# EAGLE design Adafruit SHT31-D STEMMA QT Breakout (EAGLE 9.6.2)
COMPANY: ADAFRUIT INDUSTRIES; DRAWN: KTOWN; REV: A
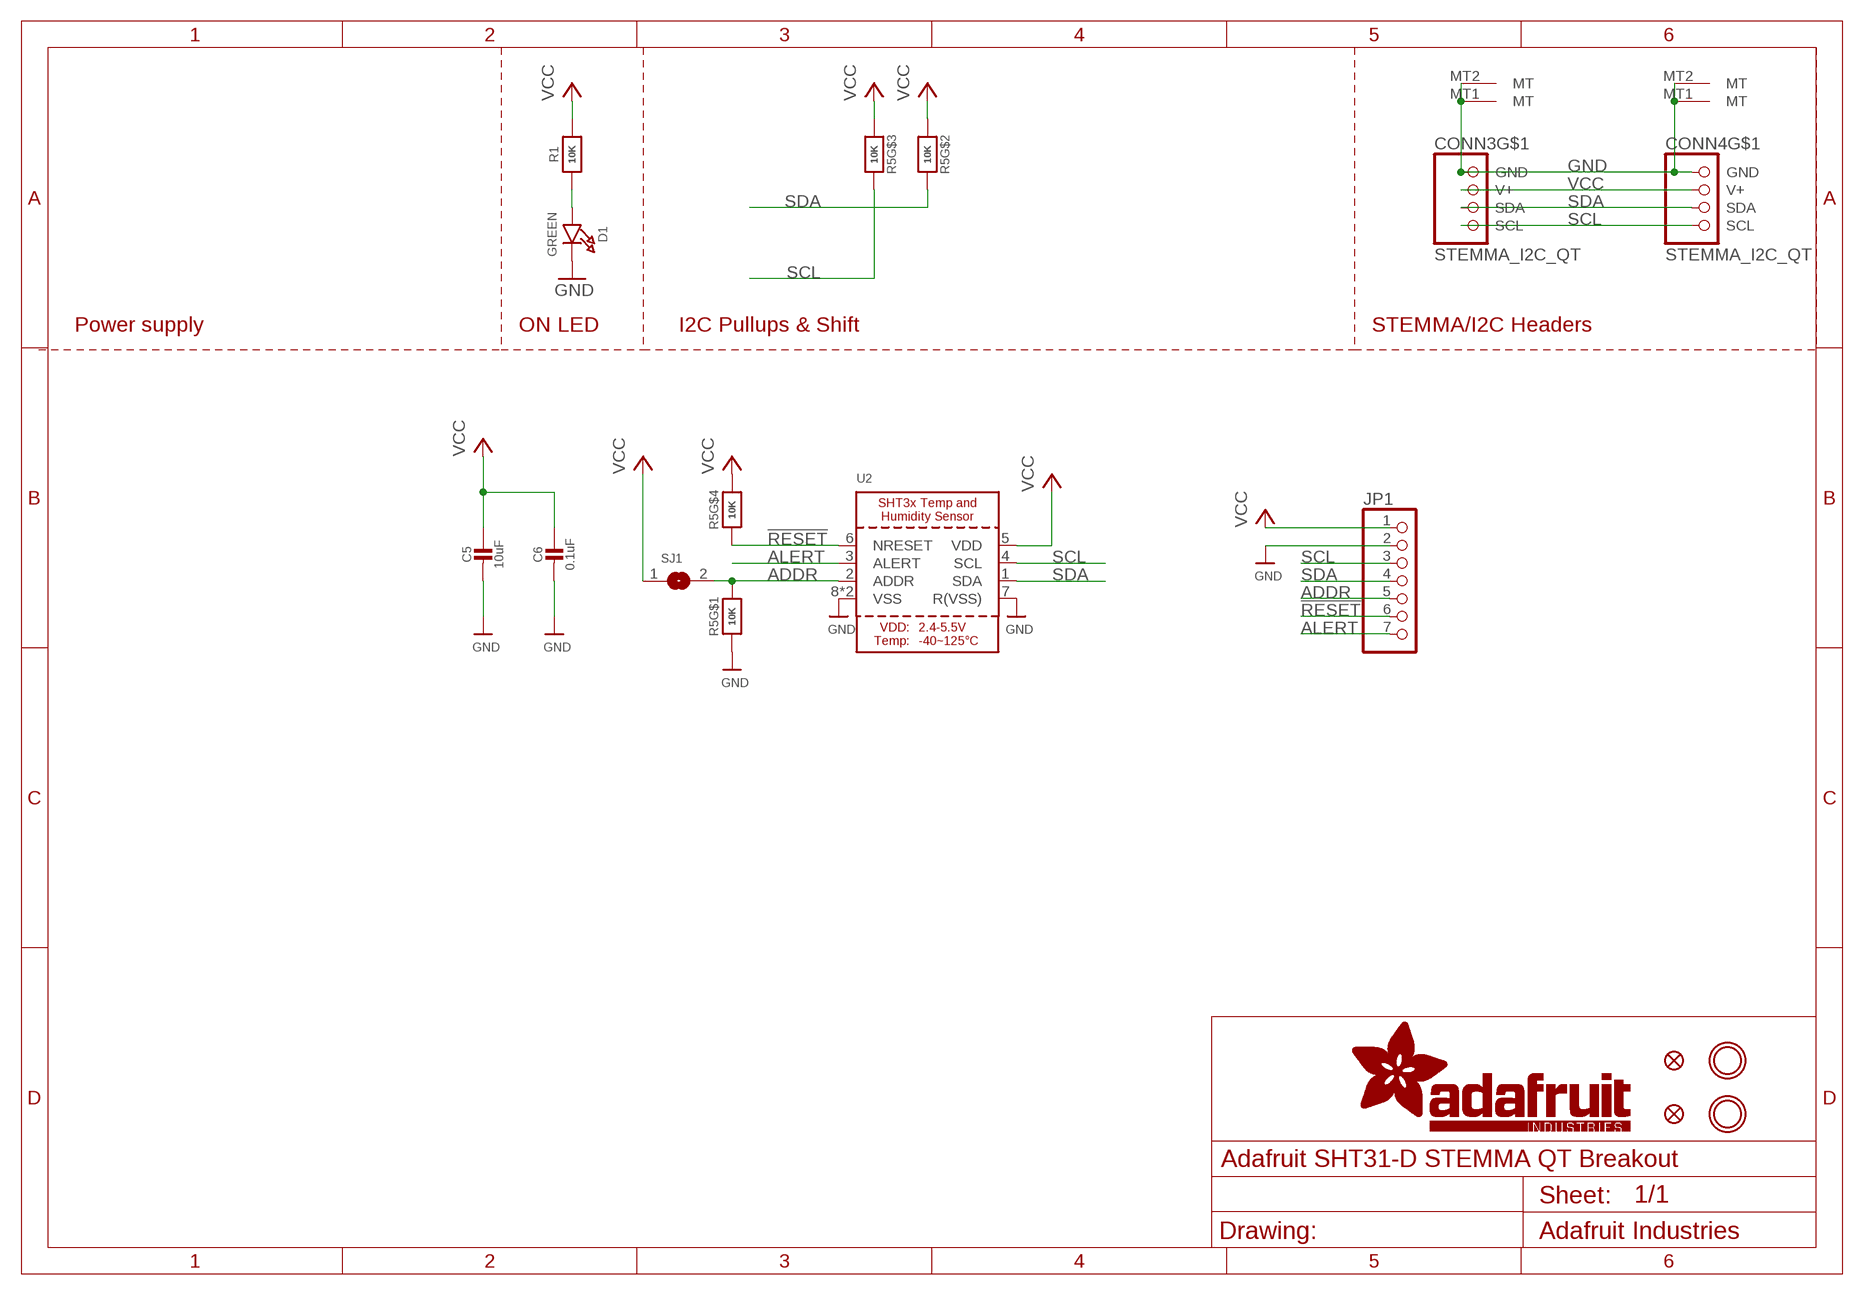
[diagram p0: schematic, sheet 1]

## Parts
C5  10uF  CAP_CERAMIC0805-NOOUTLINE  [0805-NO]
C6  0.1uF  CAP_CERAMIC0603_NO  [0603-NO]
CONN3  STEMMA_I2C_QT  [JST_SH4]
CONN4  STEMMA_I2C_QT  [JST_SH4]
D1  GREEN  LED0603_NOOUTLINE  [CHIPLED_0603_NOOUTLINE]
FID3  FIDUCIAL_1MM  [FIDUCIAL_1MM]
FID4  FIDUCIAL_1MM  [FIDUCIAL_1MM]
JP1  HEADER-1X770MIL  [1X07_ROUND_70]
R1  10K  RESISTOR_0603_NOOUT  [0603-NO]
R5  10K  RESISTOR_4PACK  [RESPACK_4X0603]
SJ1  SOLDERJUMPER  [SOLDERJUMPER_ARROW_NOPASTE]
U2  SHT3X  [SHT3X]
U$19  MOUNTINGHOLE2.5  [MOUNTINGHOLE_2.5_PLATED]
U$20  MOUNTINGHOLE2.5  [MOUNTINGHOLE_2.5_PLATED]

## Nets
!RESET: JP1.6 R5.4 U2.6(NRESET)
ADDR: JP1.5 R5.8 SJ1.2 U2.2(ADDR)
ALERT: JP1.7 U2.3(ALERT)
GND: C5.2 C6.2 CONN3.1(GND) CONN3.MT1(MT) CONN3.MT2(MT) CONN4.1(GND) CONN4.MT1(MT) CONN4.MT2(MT) D1.C JP1.2 R5.1 U2.7(R(VSS)) U2.8(VSS) U2.THERMAL(VSS)
N$1: D1.A R1.1
SCL: CONN3.4(SCL) CONN4.4(SCL) JP1.3 R5.6 U2.4(SCL)
SDA: CONN3.3(SDA) CONN4.3(SDA) JP1.4 R5.7 U2.1(SDA)
VCC [highpower]: C5.1 C6.1 CONN3.2(V+) CONN4.2(V+) JP1.1 R1.2 R5.2 R5.3 R5.5 SJ1.1 U2.5(VDD)

## Notes on the sheet
- Power supply | ON LED | I2C Pullups & Shift | STEMMA/I2C Headers

## Library data of the parts
C5 C6 = microbuilder:CAP_CERAMIC: Ceramic Capacitors For new designs, use the packages preceded by an '_' character since they are more reliable: The following footprints should be used on most boards: _0402 - Standard footprint for regular board layouts _0603 - Standard footprint for regular board layouts _0805 - Standard footprint for regular board layouts _1206 - Standard footprint for regular board layouts For extremely tight-pitch boards where space is at a premium, the following 'micro-pitch' footprints can be used (smaller pads, no silkscreen outline, etc.): _0402MP - Micro-pitch footprint for very dense/compact boards _0603MP - Micro-pitch footprint for very dense/compact boards _0805MP - Micro-pitch footprint for very dense/compact boards _1206MP - Micro-pitch footprint for very dense/compact boards
CONN3 CONN4 = microbuilder:STEMMA_I2C
D1 = microbuilder:LED: LED 0603 - 0603 Surface Mount Package 2mA: Green LED - Low Power (3.9mcd, 2ma, 1.7Vf) - Digikey: 475-2709-2-ND Orange LED - Low Power (9.8mcd, 2ma, 1.8Vf) - Digikey: 475-1194-2-ND Red LED - Low Power (5mcd, 2ma, 1.8Vf) - Digikey: 475-1195-2-ND Yellow LED - Low Power (7mcd, 2ma, 1.8Vf) - Digikey: 475-1196-2-ND 5mA: Blue LED - Low Power (17mcd, 5ma, 2.9Vf) - Digikey: LNJ937W8CRACT-ND 0805 - 0805 Surface Mount Package 2mA: Red LED (8.8mcd, 2mA, 1.8Vf, Clear) - Low Power [Digikey: 475-2510-1-ND] Green LED (5mcd, 2mA, 1.8Vf, Clear) - Low Power [Digikey: 475-2730-1-ND] Yellow LED (11.3mcd, 2mA, 1.8Vf, Clear) - Low Power [Digikey: 475-2555-1-ND] 20mA: Red LED (104mcd, 20mA, Diffused) - LS R976 [Digikey: 475-1278-6-ND] Red LED (12mcd, 20mA, 2.0Vf, Clear) - APT2012EC [Digikey: 754-1128-1-ND] Green LED (15mcd, 20mA, 2.2Vf, Clear) - APT2012GC [Digikey: 754-1131-1-ND] Orange LED (160mcd, 20mA, 2.1Vf, Clear) - APT2012SECK [Digikey: 754-1130-1-ND] 1206 - 1206 Surface Mount Package Green LED (26mcd, 20mA, Diffused) - LG N971 [Digikey: 475-1407-6-ND] Red LED (15mcd, 20mA, Diffused) - LH N974 [Digikey: 475-1416-6-ND] Cree - Cree High-Power Surface Mount LEDs XPEBWT-L1-0000-00D50 - White 111lm 350mA 2.9Vf 6200K 110° XTEAWT-00-0000-00000LEE3 - White 114lm 350mA 2.85Vf 5000K 115° Everlight - Everlight 45-21 Series Surface Mount LEDs 45-21/QK2C-B2832AC2CB2/2T - Warm White 2000mcd 20mA 3.25Vf 3050K 120° 45-21/LK2C-B38452C4CB2/2T - Nuetral White 2000mcd 20mA 3.25Vf 4150K 120° 45-21/LK2C-B50634C6CB2/2T - Cold White 2200mcd 20mA 3.25Vf 5650K 120° PLCC2 Reverse Mount LS T77K-J1L2-1-0-2-R18-Z - Red 11.25mcd 2mA 1.8Vf 630nm 120° LO T77K-L1M2-24-Z - Orange 19.6mcd 2mA 1.8Vf 606nm 120° LY T77K-K2M1-26-Z - Yellow 15.7mcd 2mA 1.8Vf 587nm 120°
FID3 FID4 = microbuilder:FIDUCIAL: Fiducial Alignment Points Various fiducial points for machine vision alignment.; BOM: EXCLUDE
JP1 = microbuilder:HEADER-1X7: PIN HEADER
R1 = microbuilder:RESISTOR: Resistors For new designs, use the packages preceded by an '_' character since they are more reliable: The following footprints should be used on most boards: _0402 - Standard footprint for regular board layouts _0603 - Standard footprint for regular board layouts _0805 - Standard footprint for regular board layouts _1206 - Standard footprint for regular board layouts For extremely tight-pitch boards where space is at a premium, the following 'micro-pitch' footprints can be used (smaller pads, no silkscreen outline, etc.): _0402MP - Micro-pitch footprint for very dense/compact boards _0603MP - Micro-pitch footprint for very dense/compact boards _0805MP - Micro-pitch footprint for very dense/compact boards _1206MP - Micro-pitch footprint for very dense/compact boards
R5 = microbuilder:RESISTOR_4PACK: Resistor Packs (4 resistors) 4 x 0603 10K 1/16W - Digikey: YC164J-10KCT-ND
SJ1 = microbuilder:SOLDERJUMPER: SMD Solder JUMPER Solder the two pads together to create a connection, or remove the solder to break it. REFLOW - Use this footprint for solder paste and reflow ovens. WAVE - Use this footprint for hand-soldering (larger pads). CLOSED - Has a trace between the two pads to ensure it is closed by default. The trace needs to be cut to disable the jumper, and can be closed again by creating a solder bridge between the two pads.; BOM: EXCLUDE
U2 = adafruit_sensor:SHT3X: SHT3x - Digital Temperature and Humidity Sensor Supply Voltage: 2.4-5.5V Humidity Accuracy: SHT30 = +/-3%RH, SHT31 = +/-2%RH Temperature Sensor: -40~125°C (+/-0.3°C from 10-55C)
U$19 U$20 = microbuilder:MOUNTINGHOLE: Mounting Hole For #2 screws (0.086"/2.18mm width, 0.094"/2.4mm hole) use 2.5mm; BOM: EXCLUDE

## Net classes
1 highpower: width 0.305 mm, drill 0.483 mm
2 lowpower: width 0.254 mm, drill 0.483 mm

## Board
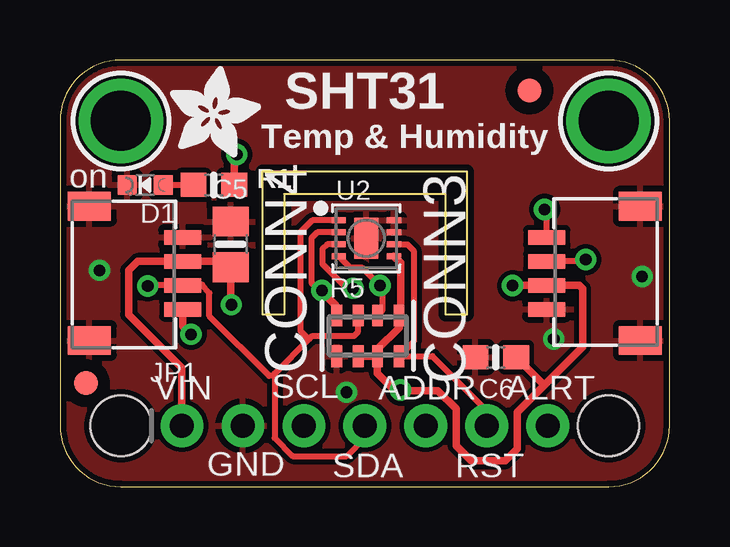
[diagram p1: board, top side]
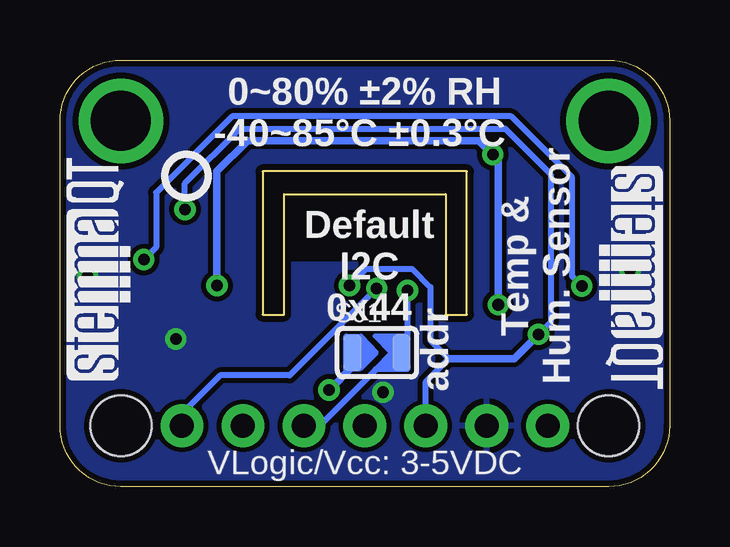
[diagram p2: board, bottom side, seen from below]

Size 25.4 x 17.78 mm. Coordinates in mm from the lower left corner, seen from the top.
Outline: 0,15.24 0,2.54 arc90 2.54,0 22.86,0 arc90 25.4,2.54 25.4,15.24 arc90 22.86,17.78 2.54,17.78 arc90 0,15.24
Outline: 8.45,13.14 16.95,13.14 16.95,7.18 16.07,7.18 16.07,12.19 9.34,12.19 9.34,7.18 8.45,7.18 8.45,13.14
Copper layers (1*16): Top 0.035mm / dielectric 1.5mm / Bottom 0.035mm
Design rules "adafruit": minimum track width 8mil, minimum drill 15.5mil, track to track 8mil, track to pad 8mil, pad to pad 8mil, via to via 8mil, smd to smd 8mil, copper to edge 10mil, drill to drill 8mil, minimum pad ring 10mil, minimum via ring 8mil, stop-mask expansion 2mil, vias tented up to drill 20mil, thermal gap 10mil
Holes 2.54 mm at 2.54,2.54 22.86,2.54
bRestrict: area 9.7,9.4 to 15.7,11.6

### Footprints (pad centres in the part's own frame; a part is rotated, then mirrored left to right if it is on the bottom)
0805-NO = smd 1.24 x 1.5: 1 -0.95,0; 2 0.95,0
0603-NO = smd 1.075 x 1: 1 -0.85,0; 2 0.85,0
JST_SH4 = smd 0.6 x 1.55: 1 -1.5,2.514; 2 -0.5,2.514; 3 0.5,2.514; 4 1.5,2.514 | smd 1.2 x 1.8: MT1 -2.8,-1.386; MT2 2.8,-1.386
CHIPLED_0603_NOOUTLINE = smd 0.8 x 0.8: A 0,-0.75; C 0,0.75
FIDUCIAL_1MM = smd 1 x 1: 1 0,0
1X07_ROUND_70 = drill 1 pad 1.778: 1 -7.62,0; 2 -5.08,0; 3 -2.54,0; 4 0,0; 5 2.54,0; 6 5.08,0; 7 7.62,0
RESPACK_4X0603 = smd 0.45 x 0.9: 1 -1.3,-0.85; 2 -0.4,-0.85; 3 0.4,-0.85; 4 1.3,-0.85; 5 1.3,0.85; 6 0.4,0.85; 7 -0.4,0.85; 8 -1.3,0.85
SOLDERJUMPER_ARROW_NOPASTE = smd 0.762 x 1.524: 1 -1.016,0; 2 1.016,0
SHT3X = smd 0.6 x 0.25: 1 -1.15,0.75; 2 -1.15,0.25; 3 -1.15,-0.25; 4 -1.15,-0.75; 5 1.15,-0.75; 6 1.15,-0.25; 7 1.15,0.25; 8 1.15,0.75 | smd 1 x 1.7: THERMAL 0,0
MOUNTINGHOLE_2.5_PLATED = drill 2.5 pad 3.2: P$1 0,0

### Placement (x,y rotation side)
C5  7.11,10.1 90 top
C6  18.16,5.4 180 top
CONN3  22.8,8.89 90 top
CONN4  2.6,8.89 270 top
D1  3.56,12.57 90 top
FID3  1.08,4.32 0 top
FID4  19.56,16.51 0 top
JP1  12.7,2.54 0 top
R1  6.41,12.57 0 top
R5  12.83,6.29 0 top
SJ1  12.19,5.59 0 bottom
U2  12.76,10.35 0 top
U$19  2.54,15.24 0 top
U$20  22.86,15.24 0 top
U$28  [ADAFRUIT_3.5MM]  4.57,13.72 0 top
U$29  [PCBFEAT-REV-040]  20.13,12.95 0 bottom
U$30  [STEMMAQT]  22.48,4.45 90 bottom
U$31  [STEMMAQT]  2.92,13.34 270 bottom

### Tracks (layer width: path | path; a pad name or v marks a point on that pad's centre or on a via)
!RESET
  Top 0.254: U2.6 14.47,10.1 14.73,9.84 14.73,6.04 R5.4 15.52,5.44 17.78,3.17 JP1.6
ADDR  (via drill 0.48)
  Top 0.254: U2.2 10.73,10.6 10.48,10.35 10.48,8.51 11.53,7.46 R5.8 11.53,7.57 v10.92,8.17
  Bottom 0.254: v10.92,8.17 10.92,6.2 11.1,6.02 14.58,2.54 JP1.5
  Bottom 0.305: SJ1.2 11.18,5.95 11.1,6.02
ALERT  (via drill 0.48)
  Top 0.254: U2.3 11.13,10.1 10.94,9.91 10.94,9.28 11.95,8.27 v12.21,8.27
  Bottom 0.254: JP1.7 20.32,3.05 18.73,4.64 15.84,4.64 v12.21,8.27
GND  (via drill 0.48)
  other vias: 1.65,9.02 24.26,8.76 20.57,6.16 11.94,3.94
  pour Top: 0,17.78 25.4,17.78 25.4,0 0,0
  pour Bottom: 0,17.84 25.4,17.84 25.4,0 0,0
N$1
  Top 0.254: D1.A R1.1
SCL  (via drill 0.48)
  Top 0.254: U2.4 12.1,9.12 12.6,9.12 v13.34,8.38 13.42,8.3 13.42,7.33 R5.6 | CONN3.4 20.28,11.47 v20.19,11.56
  Top 0.305: v5.46,6.35 5.12,6.69 CONN4.4
  Bottom 0.254: v20.19,11.56 20.19,12.64 17.91,14.92 6.86,14.92 4.95,13.02 4.95,6.86 v5.46,6.35 | v13.34,8.38 12.64,9.08 10.73,9.08 9.97,8.32 9.97,6.1 9.21,5.33 10.16,4.38 JP1.3
  Bottom 0.305: v5.46,6.35 6.48,5.33 9.21,5.33
SDA  (via drill 0.48)
  Top 0.254: U2.1 10.52,11.1 10.02,10.6 10.02,6.49 10.35,6.16 10.39,6.16 | JP1.4 12.7,2.03 11.94,1.27 9.71,1.27 8.94,2.04 8.94,4.62 | CONN4.3 3.68,8.39 v3.66,8.37 | v21.91,9.46 21.84,9.39 CONN3.3 | 8.94,4.62 8.71,4.62 6.22,7.11 6.22,8.06 5.9,8.39 | R5.7 12.43,6.46 12.26,6.29 10.52,6.29 10.39,6.16 | 10.39,6.16 8.94,4.71 8.94,4.62
  Top 0.305: 5.9,8.39 CONN4.3
  Bottom 0.254: v3.66,8.37 4.06,8.77 4.06,12.89 6.6,15.43 18.22,15.43 21.4,12.26 21.4,9.97 v21.91,9.46
VCC  (via drill 0.48)
  Top 0.305: U2.5 14.19,9.32 14.19,7.2 R5.5 14.13,6.63 13.23,5.73 R5.3 | R5.3 13.23,4.72 13.94,4 14.35,4 | 14.35,4 15.75,4 16.51,3.24 16.51,1.71 17.14,1.08 18.54,1.08 19.05,1.59 19.05,3.11 20.13,4.19 | 20.13,4.19 21.78,5.84 21.78,8.26 21.64,8.39 CONN3.2 v18.87,8.39 v18.86,8.38 | C6.1 20.13,4.28 20.13,4.19 | v7.14,7.58 7.11,7.61 C5.1 6.87,9.39 CONN4.2 3.23,9.39 2.86,9.02 2.86,7.18 5.08,4.95 JP1.1 | R5.3 R5.2 | R1.2 7.26,13.74 v7.37,13.84 | v14.19,4.03 14.32,4.03 14.35,4
  Bottom 0.305: v18.86,8.38 18.86,13.14 17.58,14.42 7.95,14.42 v7.37,13.84 7.14,13.62 v7.14,7.58 | SJ1.1 13.21,5.01 v14.19,4.03

### Text on the board
tPlace: SHT31 | Temp & Humidity | on | VIN | SCL | ADDR | ALRT | GND | SDA | RST
bPlace: 0~80% ±2% RH / -40~85°C ±0.3°C | Temp & / Hum. Sensor | Default / I2C / 0x44 | addr | VLogic/Vcc: 3-5VDC